# EAGLE design LilyPad SimplePower_45_degree_for_panelization (EAGLE 7.1.0)
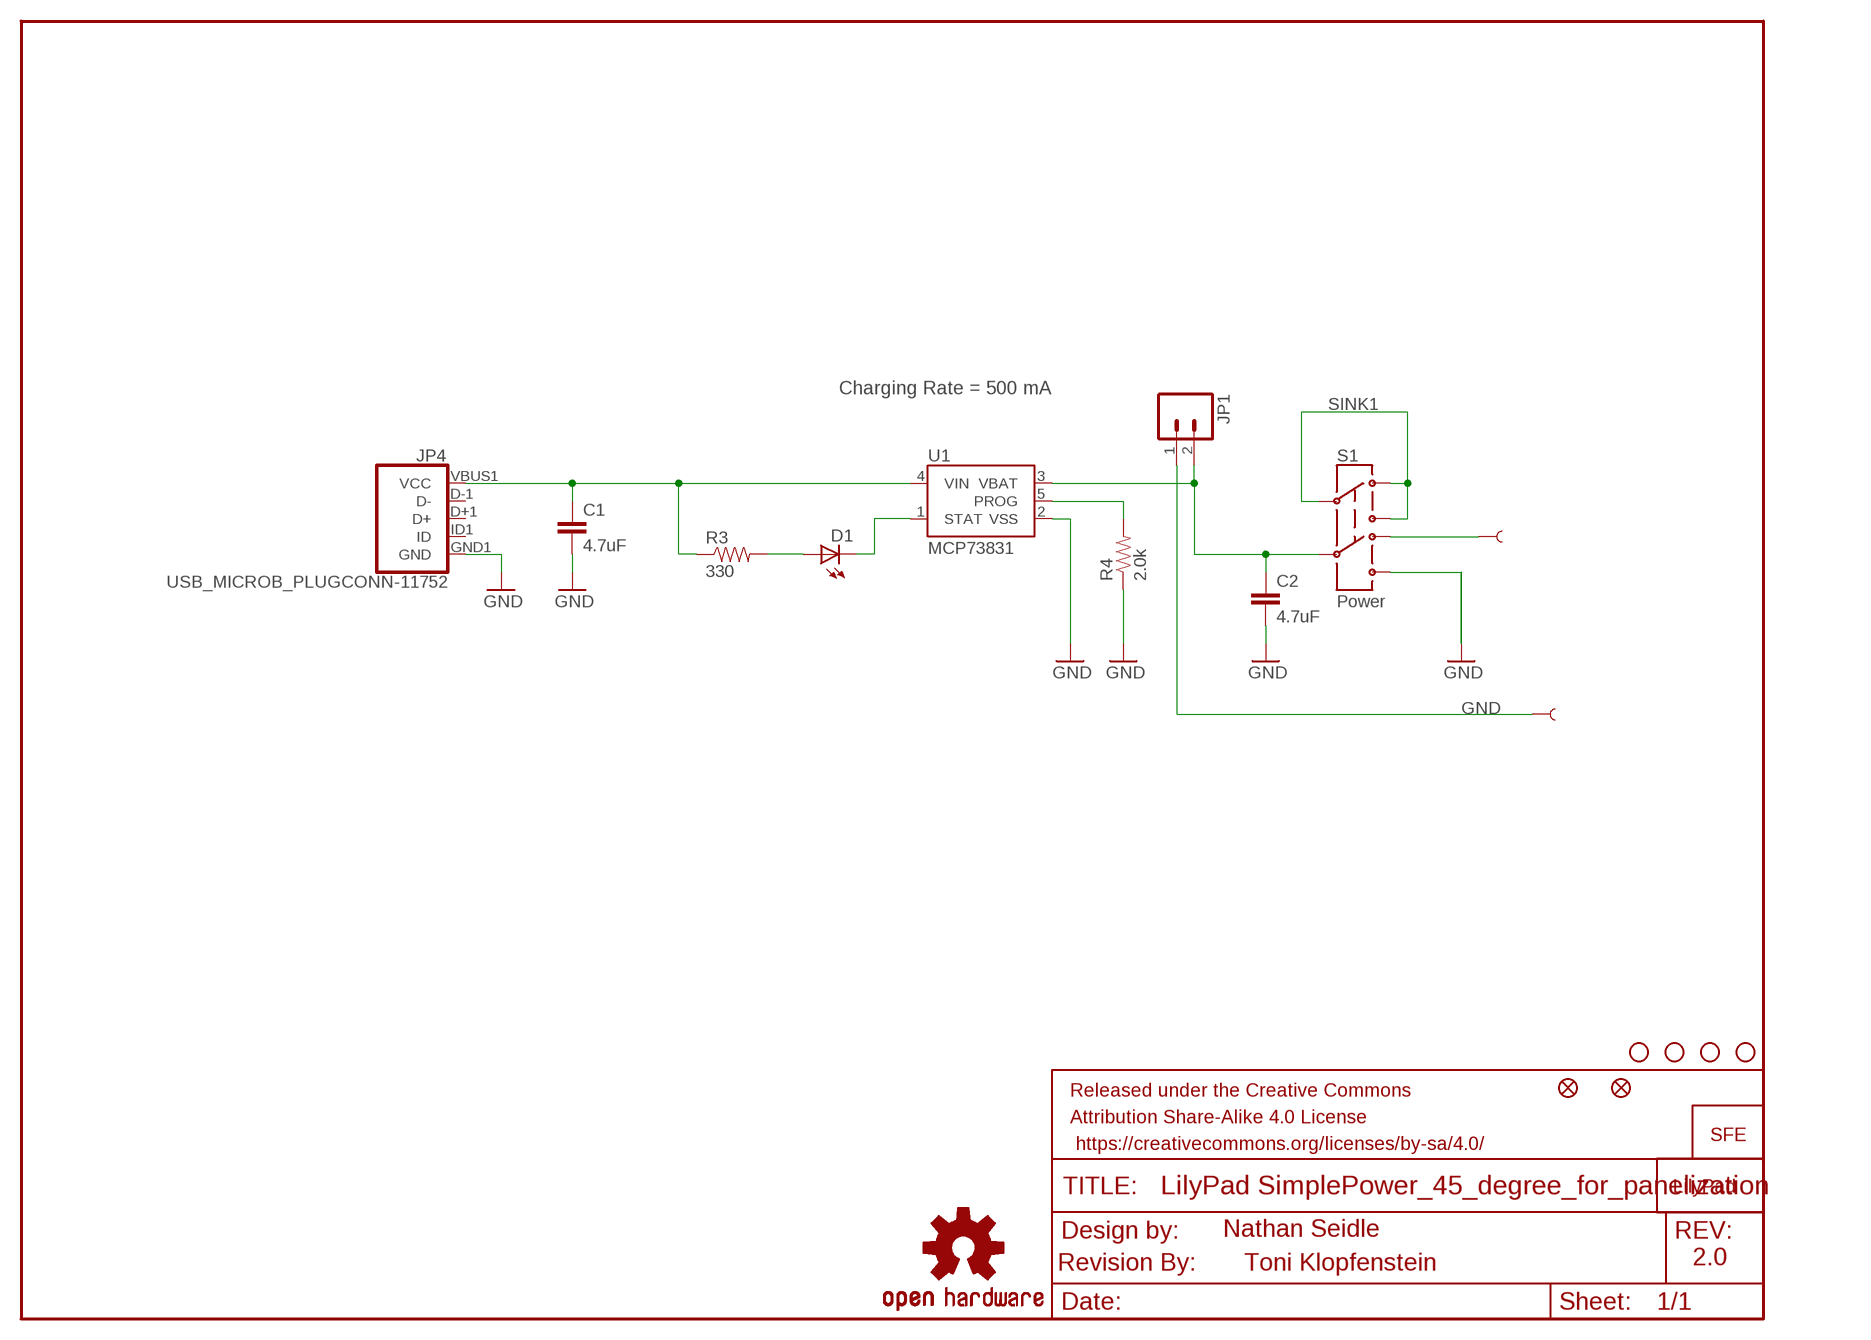
[diagram p0: schematic, sheet 1]

## Parts
C1  4.7uF  4.7UF-6.3V-10%(0603)0603  [0603-CAP]
C2  4.7uF  4.7UF-6.3V-10%(0603)0603  [0603-CAP]
D1  LED-YELLOW0603  [LED-0603]
FID1  FIDUCIAL1X2  [FIDUCIAL-1X2]
FID2  FIDUCIAL1X2  [FIDUCIAL-1X2]
FRAME1  FRAME-LETTER  [CREATIVE_COMMONS]
JP1  M02-JST-2MM-SMT  [JST-2-SMD]
JP3  LOGO-SFESK  [SFE-LOGO-FLAME]
JP4  USB_MICROB_PLUGCONN-11752  [USB-B-MICRO-SMD_V03]
R3  330  330OHM1/10W1%(0603)  [0603-RES]
R4  2.0k  2.0KOHM1/10W5%(0603)  [0603-RES]
S1  Power  SWITCH-DPDTSMD  [AYZ0202]
STANDOFF1  SEW-HOLE-NO-PAD  [SEW-HOLE-NO-PAD]
STANDOFF2  SEW-HOLE-NO-PAD  [SEW-HOLE-NO-PAD]
STANDOFF3  SEW-HOLE-NO-PAD  [SEW-HOLE-NO-PAD]
STANDOFF4  SEW-HOLE-NO-PAD  [SEW-HOLE-NO-PAD]
U1  MCP73831  [SOT23-5]
U$1  LOGO-LPLP  [LOGO-LILYPAD]
U$3  SEWTAP9  [PETAL-LONG-1-2SIDE]
U$4  SEWTAP9  [PETAL-LONG-1-2SIDE]
U$5  OSHW-LOGOS  [OSHW-LOGO-S]
U$6  REVISION  [REVISION]

## Nets
GND: C1.2 C2.2 JP1.1 JP4.GND1(GND) R4.1 S1.6 U1.2(VSS) U$3.1
N$1: C2.1 JP1.2 S1.5 U1.3(VBAT)
N$3: C1.1 JP4.VBUS1(VCC) R3.1 U1.4(VIN)
N$4: D1.C U1.1(STAT)
N$5: D1.A R3.2
N$6: S1.4 U$4.1
N$7: R4.2 U1.5(PROG)
SINK1: S1.1 S1.2 S1.3
Unconnected: JP4.D+1(D+) JP4.D-1(D-) JP4.ID1(ID)

## Notes on the sheet
- Charging Rate = 500 mA
- Nathan Seidle
- Toni Klopfenstein | 2.0

## Library data of the parts
C1 C2 = SparkFun-Capacitors:4.7UF-6.3V-10%(0603): CAP-08280; PROD_ID: CAP-08280
D1 = SparkFun-LED:LED-YELLOW: Yellow SMD LEDs LilyPad 1206- DIO-09909 0603- DIO-09003; PROD_ID: DIO-09003
FID1 FID2 = SparkFun-Aesthetics:FIDUCIAL: Fiducial Alignment Points Various fiducial points for machine vision alignment.
FRAME1 = SparkFun-Aesthetics:FRAME-LETTER: Schematic Frame Standard 8.5x11 US Letter frame
JP1 = SparkFun:M02: Header 2 Standard 2-pin 0.1" header. Use with straight break away headers (SKU : PRT-00116), right angle break away headers (PRT-00553), swiss pins (PRT-00743), machine pins (PRT-00117), and female headers (PRT-00115). Molex polarized connector foot print use with SKU : PRT-08233 with associated crimp pins and housings.
JP3 = SparkFun-Aesthetics:LOGO-SFE: Spark Fun Electronics PCB Logo This is the standard Spark Fun Electronics PCB logo.
JP4 = SparkFun-Connectors:USB_MICROB_PLUG: USB Micro-B Plug Comes in a variety of packages. Check out Hirose's ZX-x0 line: http://www.hirose.co.jp/cataloge_hp/e24200011.pdf; PROD_ID: CONN-11752
R3 = SparkFun-Resistors:330OHM1/10W1%(0603): RES-00818; PROD_ID: RES-00818
R4 = SparkFun-Resistors:2.0KOHM1/10W5%(0603): RES-08296; PROD_ID: RES-08296
S1 = SparkFun:SWITCH-DPDT: DPDT Version of the COM-00597
STANDOFF1-STANDOFF4 = Local Library:SEW-HOLE-NO-PAD: #4 Stand Off This is the mechanical footprint for a #4 phillips button head screw. Use the keepout ring to avoid running the screw head into surrounding components. SKU : PRT-00447
U1 = SparkFun-PowerIC:MCP73831: Miniature single cell, fully integrated Li-Ion, Li-polymer charge management controller http://ww1.microchip.com/downloads/en/DeviceDoc/21984a.pdf IC-09995; PROD_ID: IC-09995
U$1 = LilyPad-Wearables:LOGO-LP
U$3 U$4 = LilyPad-Wearables:SEWTAP
U$5 = SparkFun-Aesthetics:OSHW-LOGO: Open Source Hardware Logo This logo indicates the piece of hardware it is found on incorporates a OSHW license and/or adheres to the definition of open source hardware found here: http://freedomdefined.org/OSHW
U$6 = SparkFun-Aesthetics:REVISION

## Board
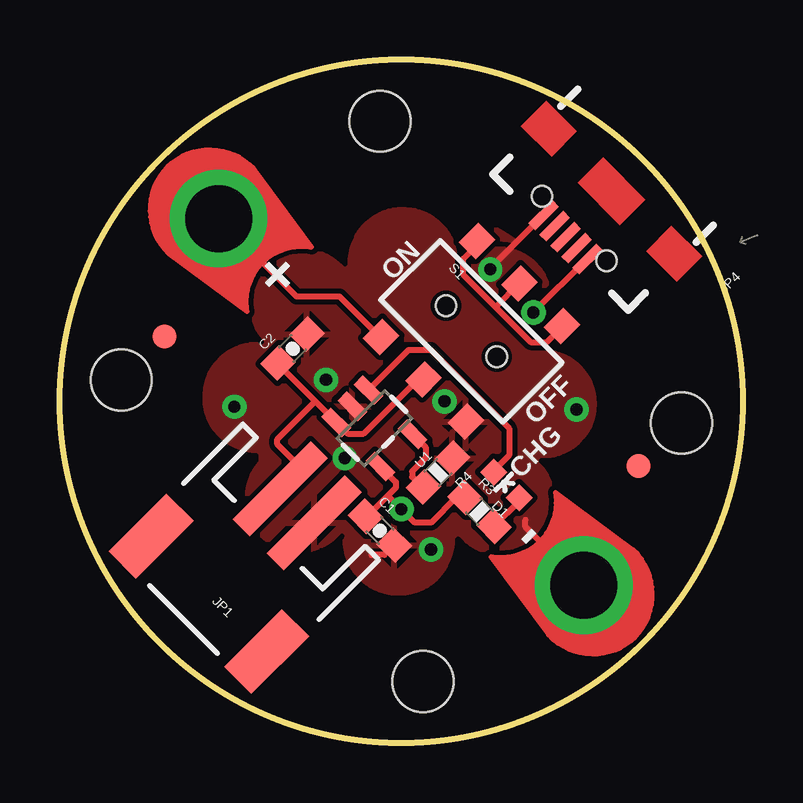
[diagram p1: board, top side]
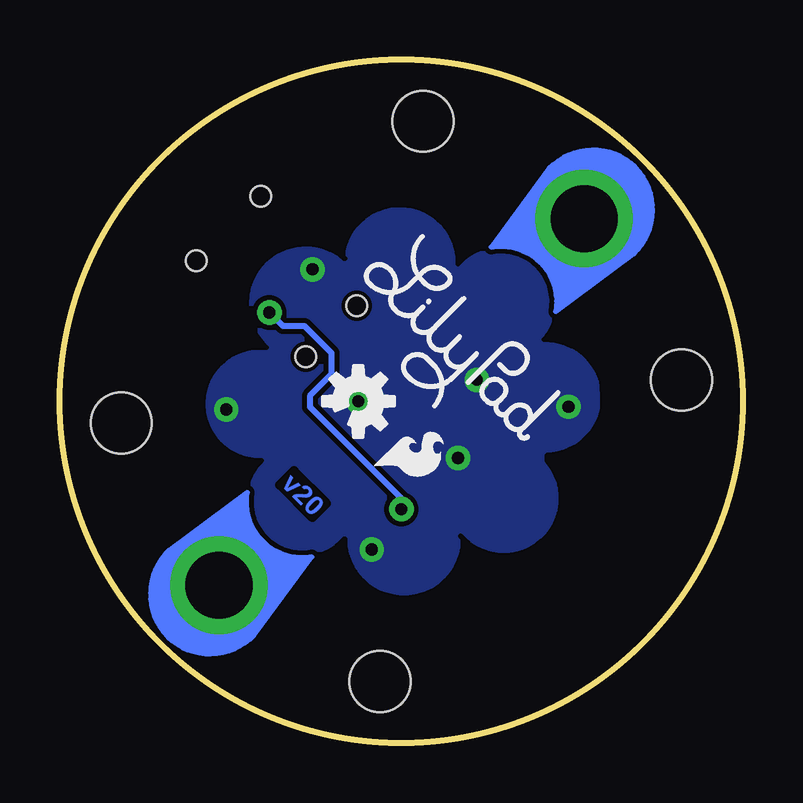
[diagram p2: board, bottom side, seen from below]

Size 28.45 x 28.45 mm. Coordinates in mm from the lower left corner, seen from the top.
Outline: circle at 14.22,14.22 radius 14.22
Copper layers (1*16): Top 0.035mm / dielectric 1.5mm / Bottom 0.035mm
Design rules "SparkFun-2-layer": minimum track width 7mil, minimum drill 15mil, track to track 8mil, track to pad 8mil, pad to pad 8mil, via to via 8mil, smd to smd 8mil, copper to edge 8mil, drill to drill 8mil, minimum pad ring 12mil, minimum via ring 10mil, stop-mask expansion 4mil, vias tented up to drill 20mil, thermal gap 10mil
tRestrict: area 2.9,2.9 to 25.6,25.6; 8 lines
bRestrict: area 2.9,2.9 to 25.6,25.6; 8 lines

### Footprints (pad centres in the part's own frame; a part is rotated, then mirrored left to right if it is on the bottom)
0603-CAP = smd 1.1 x 1: 1 -0.85,0; 2 0.85,0
LED-0603 = smd 0.8 x 0.8: A 0,-0.75; C 0,0.75
FIDUCIAL-1X2 = smd 1 x 1: 1 0,0
JST-2-SMD = smd 1 x 4.6: 1 -1,-3.7; 2 1,-3.7 | smd 1.6 x 3.4: NC1 -3.4,1.5; NC2 3.4,1.5
USB-B-MICRO-SMD_V03 = smd 1.4 x 0.4: D+1 2.7,0; D-1 2.7,0.65; GND1 2.7,-1.3; ID1 2.7,-0.65; VBUS1 2.7,1.3 | hole 0.85: 2.2,1.9; 2.2,-1.9
0603-RES = smd 1.1 x 1: 1 -0.85,0; 2 0.85,0
AYZ0202 = smd 1 x 1.15: 1 -2.5,2.825; 2 0,2.825; 3 2.5,2.825; 4 -2.5,-2.825; 5 0,-2.825; 6 2.5,-2.825 | hole 0.85: 1.5,0; -1.5,0
SEW-HOLE-NO-PAD = hole 2.54: 0,0
SOT23-5 = smd 0.55 x 1.2: 1 -0.95,-1.3; 2 0,-1.3; 3 0.95,-1.3; 4 0.95,1.3; 5 -0.95,1.3
PETAL-LONG-1-2SIDE = drill 2.794 pad 4.064: 1 0.03,0

### Placement (x,y rotation side)
C1  13.33,8.84 315 top
C2  9.69,16.42 45 top
D1  18.6,10.74 45 top
FID1  4.35,16.92 45 top
FID2  24.1,11.53 45 top
FRAME1  -8.37,-11.46 0 top  (outside the outline)
JP1  7.26,7.26 135 top
JP3  15.35,11.53 315 bottom
JP4  22.98,22.98 225 top
R3  17.48,9.62 315 top
R4  15.75,11.26 225 top
S1  17.14,17.14 315 top
STANDOFF1  2.55,15.12 45 top
STANDOFF2  13.33,25.9 45 top
STANDOFF3  25.9,13.33 45 top
STANDOFF4  15.12,2.55 45 top
U1  13.1,13.1 225 top
U$1  11.75,16.69 315 bottom
U$3  21.84,6.54 135 top
U$4  6.59,21.86 315 top
U$5  16.02,14.22 315 bottom
U$6  3.17,-13.87 0 top  (outside the outline)

### Tracks (layer width: path | path; a pad name or v marks a point on that pad's centre or on a via)
GND  (via drill 0.51)
  Top 0.203: U$3.1 20.22,8.16
  Top 0.254: 20.4,8.05 20.29,8.16 | 20.17,8.27 20.06,8.39 | JP4.GND1 17.93,19.77 v17.93,19.72 | 19.39,9.28 19.39,9 20.06,8.32 20.06,8.16 | C1.2 13.52,7.83 12.99,7.83 | JP1.1 10.74,9.17 11.19,9.62 11.42,9.62 11.3,9.51 | 20.29,8.16 20.17,8.05 20.06,8.16 | 20.06,8.16 20.17,8.27 | 20.17,8.27 20.29,8.16 | 20.4,8.05 20.73,7.71 | 20.22,8.16 20.33,8.05 20.4,8.05
  Bottom 0.254: 15.57,15.12 15.57,14.67 v16.02,14.22
  other vias: 11.87,11.87 7.26,14 11.08,15.12 21.52,13.89 15.46,8.05
  pour Bottom: -0.64,29.94 -0.64,-0.54 29.2,-0.54 29.2,29.94
  pour Top: -0.64,29.94 -0.64,-0.54 29.2,-0.54 29.2,29.94
N$1
  Top 0.254: 15.14,14.7 S1.5 14.92,15.14 12.65,12.88 11.98,12.88 U1.3 10.63,14.23 | 10.63,14.23 9.09,15.77 C2.1 | JP1.2 10,11.42 10.07,11.42 9.06,12.43 9.06,12.65 10.63,14.23
N$3  (via drill 0.51)
  Top 0.254: v19.72,17.93 21.95,20.15 JP4.VBUS1 | U1.4 14,10.86 14,10.63 13.66,10.29 | 13.66,10.29 12.8,9.44 C1.1 | 13.66,10.29 v14.22,9.73 14.78,9.17 15.46,9.17 16.51,10.22 R3.1
  Bottom 0.254: v14.22,9.73 14.22,10.18 18.04,14 18.04,14.45 17.14,15.35 17.14,16.24 18.26,17.37 19.16,17.37 v19.72,17.93
N$4
  Top 0.254: U1.1 14.52,16.36 15.46,16.36 18.71,13.1 18.71,11.98 18.07,11.34 D1.C
N$5
  Top 0.254: R3.2 19.13,10.07 D1.A
N$6
  Top 0.254: U$4.1 9.85,18.6 11.64,18.6 13.33,16.91 S1.4
N$7
  Top 0.254: U1.5 15.23,12.32 15.23,11.87 14.67,11.3 14.67,11.08 15.09,10.66 R4.2
SINK1
  Top 0.254: S1.3 20.91,17.32 20.29,16.69 19.61,16.69 18.15,18.15 | S1.1 17.37,20.74 16.81,20.17 16.81,19.5 18.15,18.15 | S1.2 18.15,18.15

### Text on the board
Bottom: v20
tPlace: ON | + | OFF | CHG | -
tDocu: N. Seidle | Toni Klopfenstein